# Altium schematic sheet STM32_VCC.SchDoc
size A4
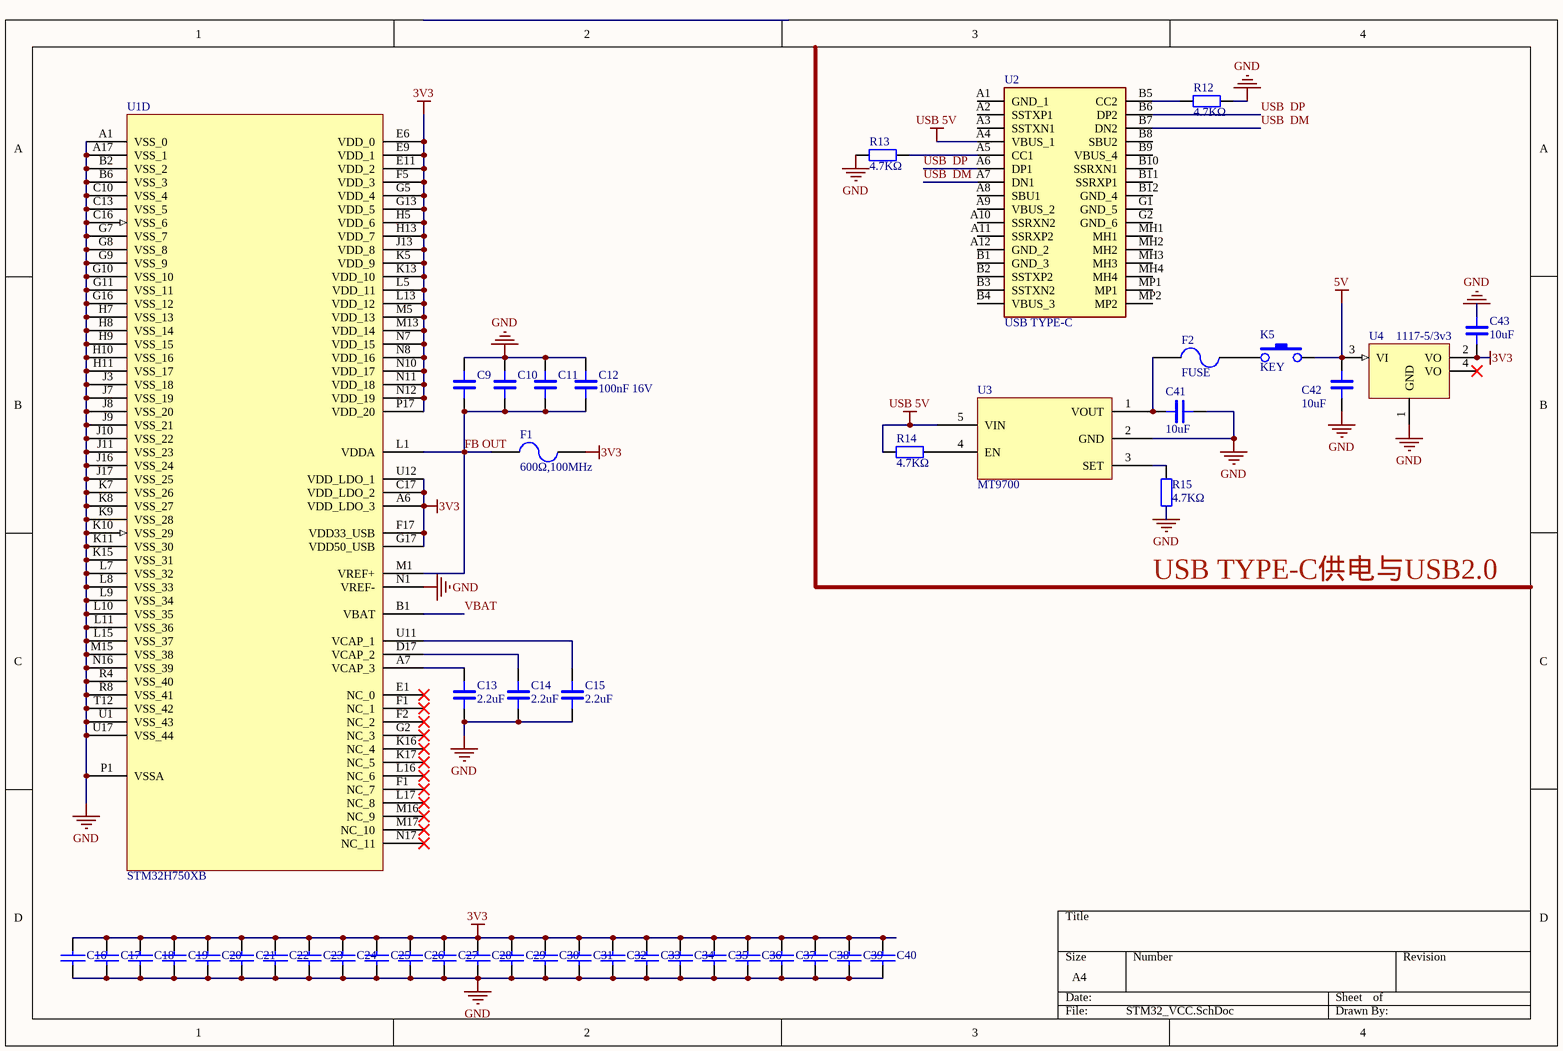
[diagram p0: STM32_VCC.SchDoc]

## Parts
C9  100nF 16V  [0805]  (value not drawn)
C10  100nF 16V  [0805]  (value not drawn)
C11  100nF 16V  [0805]  (value not drawn)
C12  100nF 16V  [0805]
C13  2.2uF  [0805]
C14  2.2uF  [0805]
C15  2.2uF  [0805]
C16  104 16V  [0805C]  (value not drawn)
C17  104 16V  [0805C]  (value not drawn)
C18  104 16V  [0805C]  (value not drawn)
C19  104 16V  [0805C]  (value not drawn)
C20  104 16V  [0805C]  (value not drawn)
C21  104 16V  [0805C]  (value not drawn)
C22  104 16V  [0805C]  (value not drawn)
C23  104 16V  [0805C]  (value not drawn)
C24  104 16V  [0805C]  (value not drawn)
C25  104 16V  [0805C]  (value not drawn)
C26  104 16V  [0805C]  (value not drawn)
C27  104 16V  [0805C]  (value not drawn)
C28  104 16V  [0805C]  (value not drawn)
C29  104 16V  [0805C]  (value not drawn)
C30  104 16V  [0805C]  (value not drawn)
C31  104 16V  [0805C]  (value not drawn)
C32  104 16V  [0805C]  (value not drawn)
C33  104 16V  [0805C]  (value not drawn)
C34  104 16V  [0805C]  (value not drawn)
C35  104 16V  [0805C]  (value not drawn)
C36  104 16V  [0805C]  (value not drawn)
C37  104 16V  [0805C]  (value not drawn)
C38  104 16V  [0805C]  (value not drawn)
C39  104 16V  [0805C]  (value not drawn)
C40  104 16V  [0805C]  (value not drawn)
C41  10uF  [0805]
C42  10uF  [0805]
C43  10uF  [CAP-0805]
F1  600Ω,100MHz  [FUSE-1210]
F2  FUSE  [FUSE-1210]
K5  KEY  [DIP-3X6X4.3]
R12  4.7KΩ  [0805]
R13  4.7KΩ  [0805]
R14  4.7KΩ  [0805]
R15  4.7KΩ  [0805]
U1  STM32H750XB  [BGA265C80P17X17_1400X1400X110]  (part D of 4)
U2  USB TYPE-C  [632723100011]
U3  MT9700  [SOT-23-5]
U4  1117-5/3v3  [SOT-23]

## Nets
3V3: C16.2 C17.2 C18.2 C19.2 C20.2 C21.2 C22.2 C23.2 C24.2 C25.2 C26.2 C27.2 C28.2 C29.2 C30.2 C31.2 C32.2 C33.2 C34.2 C35.2 C36.2 C37.2 C38.2 C39.2 C40.2 C43.2 F1.2 U1.A6(VDD_LDO_3) U1.C17(VDD_LDO_2) U1.E6(VDD_0) U1.E9(VDD_1) U1.E11(VDD_2) U1.F5(VDD_3) U1.F17(VDD33_USB) U1.G5(VDD_4) U1.G13(VDD_5) U1.G17(VDD50_USB) U1.H5(VDD_6) U1.H13(VDD_7) U1.J13(VDD_8) U1.K5(VDD_9) U1.K13(VDD_10) U1.L5(VDD_11) U1.L13(VDD_12) U1.M5(VDD_13) U1.M13(VDD_14) U1.N7(VDD_15) U1.N8(VDD_16) U1.N10(VDD_17) U1.N11(VDD_18) U1.N12(VDD_19) U1.P17(VDD_20) U1.U12(VDD_LDO_1) U4.2(VO)
5V: C42.1 K5.3 U4.3(VI)
GND: C9.2 C10.2 C11.2 C12.2 C13.1 C14.1 C15.1 C16.1 C17.1 C18.1 C19.1 C20.1 C21.1 C22.1 C23.1 C24.1 C25.1 C26.1 C27.1 C28.1 C29.1 C30.1 C31.1 C32.1 C33.1 C34.1 C35.1 C36.1 C37.1 C38.1 C39.1 C40.1 C41.1 C42.2 C43.1 R12.1 R13.2 R15.2 U1.A1(VSS_0) U1.A17(VSS_1) U1.B2(VSS_2) U1.B6(VSS_3) U1.C10(VSS_4) U1.C13(VSS_5) U1.C16(VSS_6) U1.G7(VSS_7) U1.G8(VSS_8) U1.G9(VSS_9) U1.G10(VSS_10) U1.G11(VSS_11) U1.G16(VSS_12) U1.H7(VSS_13) U1.H8(VSS_14) U1.H9(VSS_15) U1.H10(VSS_16) U1.H11(VSS_17) U1.J3(VSS_18) U1.J7(VSS_19) U1.J8(VSS_20) U1.J9(VSS_21) U1.J10(VSS_22) U1.J11(VSS_23) U1.J16(VSS_24) U1.J17(VSS_25) U1.K7(VSS_26) U1.K8(VSS_27) U1.K9(VSS_28) U1.K10(VSS_29) U1.K11(VSS_30) U1.K15(VSS_31) U1.L7(VSS_32) U1.L8(VSS_33) U1.L9(VSS_34) U1.L10(VSS_35) U1.L11(VSS_36) U1.L15(VSS_37) U1.M15(VSS_38) U1.N1(VREF-) U1.N16(VSS_39) U1.P1(VSSA) U1.R4(VSS_40) U1.R8(VSS_41) U1.T12(VSS_42) U1.U1(VSS_43) U1.U17(VSS_44) U3.2(GND) U4.1(GND)
USB 5V: R14.2 U2.A4(VBUS_1) U3.5(VIN)
FB OUT: C9.1 C10.1 C11.1 C12.1 F1.1 U1.L1(VDDA) U1.M1(VREF+)
USB  DM: U2.A7(DN1) U2.B7(DN2)
USB  DP: U2.A6(DP1) U2.B6(DP2)
VBAT: U1.B1(VBAT)
NetC13_2: C13.2 U1.A7(VCAP_3)
NetC14_2: C14.2 U1.D17(VCAP_2)
NetC15_2: C15.2 U1.U11(VCAP_1)
NetC41_2: C41.2 F2.1 U3.1(VOUT)
NetF2_2: F2.2 K5.1
NetR12_2: R12.2 U2.B5(CC2)
NetR13_1: R13.1 U2.A5(CC1)
NetR14_1: R14.1 U3.4(EN)
NetR15_1: R15.1 U3.3(SET)

Not connected (* = marked no-connect by the designer): U1 E1(NC_0)* F1(NC_1)* F2(NC_2)* G2(NC_3)* K16(NC_4)* K17(NC_5)* L16(NC_6)* L17(NC_8)* M16(NC_9)* M17(NC_10)* N17(NC_11)*; U2 A1(GND_1) A2(SSTXP1) A3(SSTXN1) A8(SBU1) A9(VBUS_2) A10(SSRXN2) A11(SSRXP2) A12(GND_2) B1(GND_3) B2(SSTXP2) B3(SSTXN2) B4(VBUS_3) B8(SBU2) B9(VBUS_4) B10(SSRXN1) B11(SSRXP1) B12(GND_4) G1(GND_5) G2(GND_6) MH1 MH2 MH3 MH4 MP1 MP2; U4 4(VO)*

## Notes on the sheet
- (near R15) USB TYPE-C供电与USB2.0

## Library data of the parts
C9-C15 C41-C43 = CAP: Capacitor
C16-C40 = CAP: 无极性电容
F1 = FUSE
F2 = FUSE: 1000mA
R12-R15 = RES: Resistor
U2 = 632723100011: Integrated Circuit; Manufacturer_Name: Wurth Elektronik; Datasheet Link: https://componentsearchengine.com/Datasheets/1/632723100011.pdf; Height: 3.11mm; Manufacturer_Part_Number: 632723100011; Mouser Part Number: 710-632723100011; Mouser Price/Stock: https://www.mouser.co.uk/ProductDetail/Wurth-Elektronik/632723100011?qs=NK6InXoXhq4o62C9ULXLjQ%3D%3D
U4 = 1117: Linear Regulator